# Altium project memristor_measure.PrjPcb
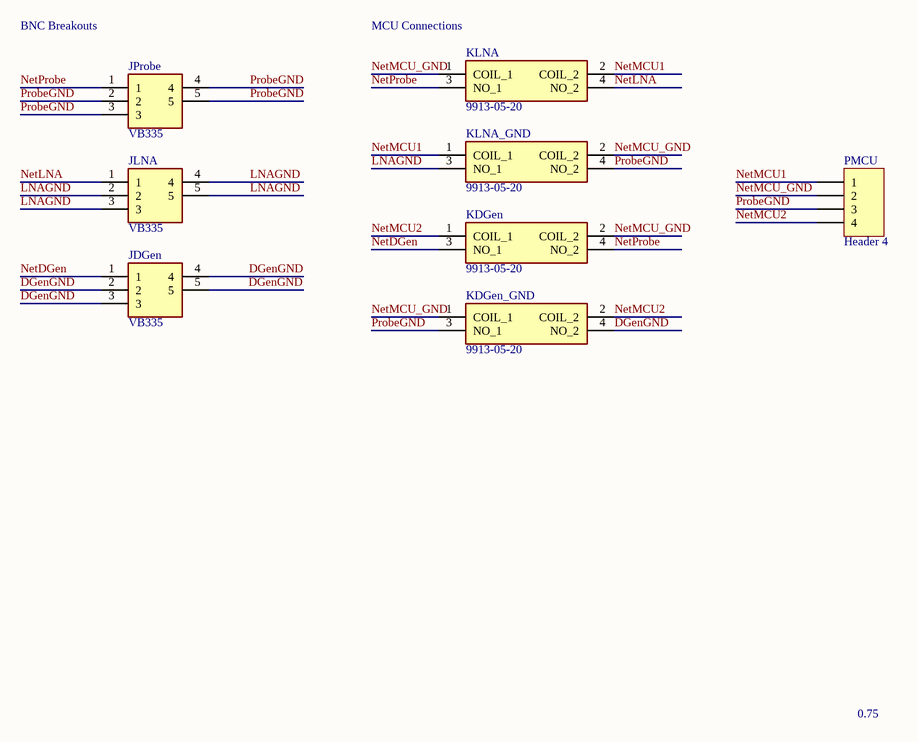
[diagram p0: memristor_measure_sch.SchDoc]
1 sheet, 8 parts. Net scope: global (net labels, ports and power ports of the same name join across sheets).
Board file: memristor_measure_pcb.PcbDoc

## Sheet memristor_measure_sch.SchDoc
size A; SheetNumber: 1; SheetTotal: 1

### Parts
JDGen  VB335  [VB335]
JLNA  VB335  [VB335]
JProbe  VB335  [VB335]
KDGen  9913-05-20  [99130520]
KDGen_GND  9913-05-20  [99130520]
KLNA  9913-05-20  [99130520]
KLNA_GND  9913-05-20  [99130520]
PMCU  Header 4  [HDR1X4]

### Nets
DGenGND: JDGen.2 JDGen.3 JDGen.4 JDGen.5 KDGen_GND.4(NO_2)
LNAGND: JLNA.2 JLNA.3 JLNA.4 JLNA.5 KLNA_GND.3(NO_1)
NetDGen: JDGen.1 KDGen.3(NO_1)
NetLNA: JLNA.1 KLNA.4(NO_2)
NetMCU1: KLNA.2(COIL_2) KLNA_GND.1(COIL_1) PMCU.1
NetMCU2: KDGen.1(COIL_1) KDGen_GND.2(COIL_2) PMCU.4
NetMCU_GND: KDGen.2(COIL_2) KDGen_GND.1(COIL_1) KLNA.1(COIL_1) KLNA_GND.2(COIL_2) PMCU.2
NetProbe: JProbe.1 KDGen.4(NO_2) KLNA.3(NO_1)
ProbeGND: JProbe.2 JProbe.3 JProbe.4 JProbe.5 KDGen_GND.3(NO_1) KLNA_GND.4(NO_2) PMCU.3

### Notes on the sheet
- BNC Breakouts
- (near KLNA) MCU Connections
- 0.75

### Library data of the parts
JDGen JLNA JProbe = VB335: Connector; Manufacturer_Name: Cinch Connectivity Solutions; Datasheet Link: https://belfuse.com/resources/drawings/cinchconnectivitysolutions/vitelec/dr-ccs-vit-vb335.pdf; Height: 18.9mm; Manufacturer_Part_Number: VB335
KDGen KDGen_GND KLNA KLNA_GND = 9913-05-20: Relay or Contactor; Manufacturer_Name: Coto Technology; Datasheet Link: https://cotorelay.com/wp-content/uploads/2015/02/9913Datasheet-15Jan2015.pdf; Height: 3.61mm; Manufacturer_Part_Number: 9913-05-20
PMCU = Header 4: Header, 4-Pin; LatestRevisionDate: 17-Jul-2002; LatestRevisionNote: Re-released for DXP Platform.; Publisher: Altium Limited